# EAGLE design uv-board (EAGLE 7.6.0)
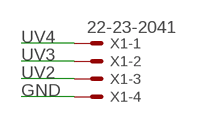
[diagram p0: schematic, sheet 1]

## Parts
UV1  UV  [UV]  (not placed on a sheet)
UV2  UV  [UV]  (not placed on a sheet)
UV3  UV  [UV]  (not placed on a sheet)
X1  22-23-2041  [22-23-2041]

## Nets
GND: X1.4
UV2: X1.3
UV3: X1.2
UV4: X1.1

## Library data of the parts
UV1-UV3 = untitled:UV: uv
X1 = con-molex:22-23-2041: .100" (2.54mm) Center Header - 4 Pin; MF: MOLEX; MPN: 22-23-2041; OC_FARNELL: 1462920; OC_NEWARK: 38C0355

## Board
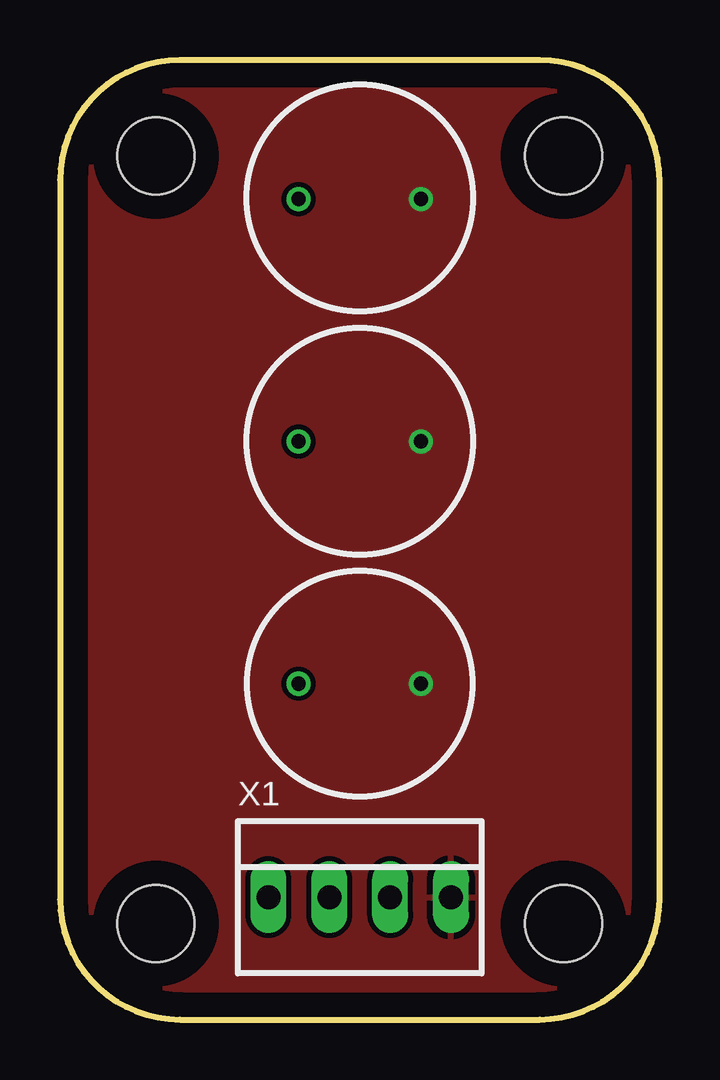
[diagram p1: board, top side]
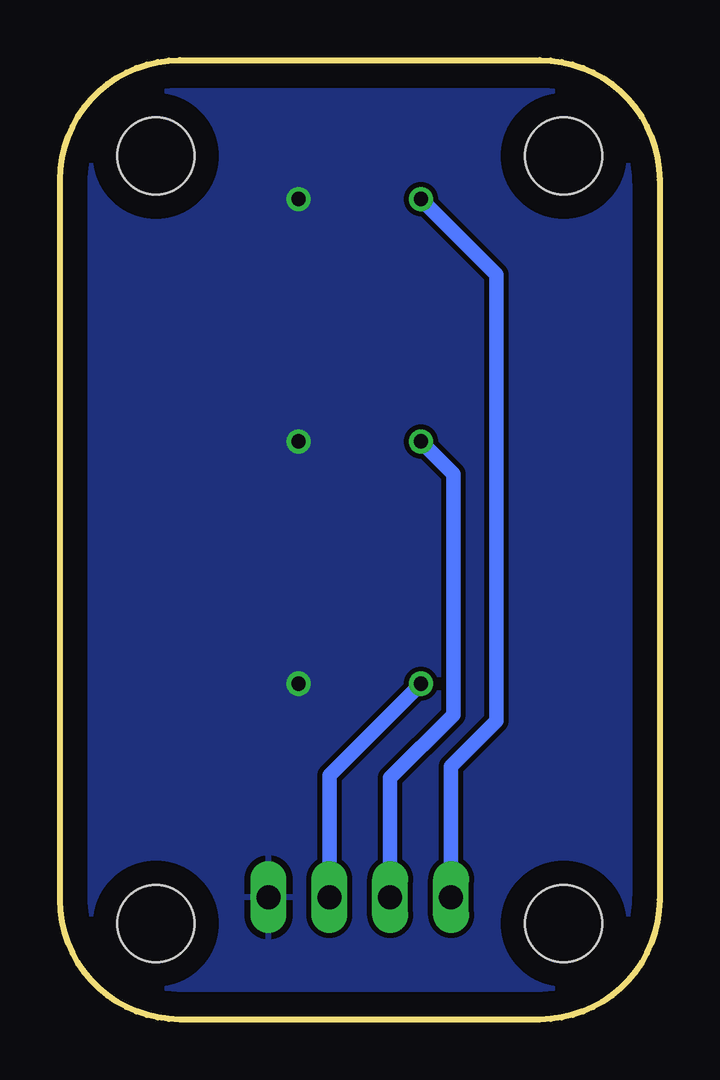
[diagram p2: board, bottom side, seen from below]

Size 25 x 40 mm. Coordinates in mm from the lower left corner, seen from the top.
Outline: 20,40 5,40 arc90 0,35 0,5 arc90 5,0 20,0 arc90 25,5 25,35 arc90 20,40
Copper layers (1*16): Top 0.035mm / dielectric 1.5mm / Bottom 0.035mm
Design rules "default": minimum track width 10mil, minimum drill 24mil, track to track 8mil, track to pad 8mil, pad to pad 8mil, via to via 8mil, smd to smd 8mil, copper to edge 40mil, drill to drill 8mil, minimum pad ring 10mil, minimum via ring 8mil, stop-mask expansion 4mil, vias tented up to drill 0mil, thermal gap 10mil
Holes 3.2 mm at 4,4 21,4 4,36 21,36

### Footprints (pad centres in the part's own frame; a part is rotated, then mirrored left to right if it is on the bottom)
22-23-2041 = drill 1 long: 1 -3.81,0; 2 -1.27,0; 3 1.27,0; 4 3.81,0

### Placement (x,y rotation side)
X1  12.5,5.1 0 top

### Tracks (layer width: path | path; a pad name or v marks a point on that pad's centre or on a via)
GND  (via drill 0.6)
  other vias: 15.05,14 15.05,24.1 15.05,34.2
  pour Top: 20,40 5,40 arc90 0,35 0,5 arc90 5,0 20,0 arc90 25,5 25,35 arc90
  pour Bottom: 20,40 5,40 arc90 0,35 0,5 arc90 5,0 20,0 arc90 25,5 25,35 arc90
UV2  (via drill 0.6)
  Bottom 0.61: X1.3 13.77,10.18 v9.95,14
UV3  (via drill 0.6)
  Bottom 0.61: X1.2 11.23,10.07 8.6,12.7 8.6,22.75 v9.95,24.1
UV4  (via drill 0.6)
  Bottom 0.61: X1.1 8.69,10.56 6.8,12.45 6.8,31.05 v9.95,34.2